# Altium project AND.PrjPcb
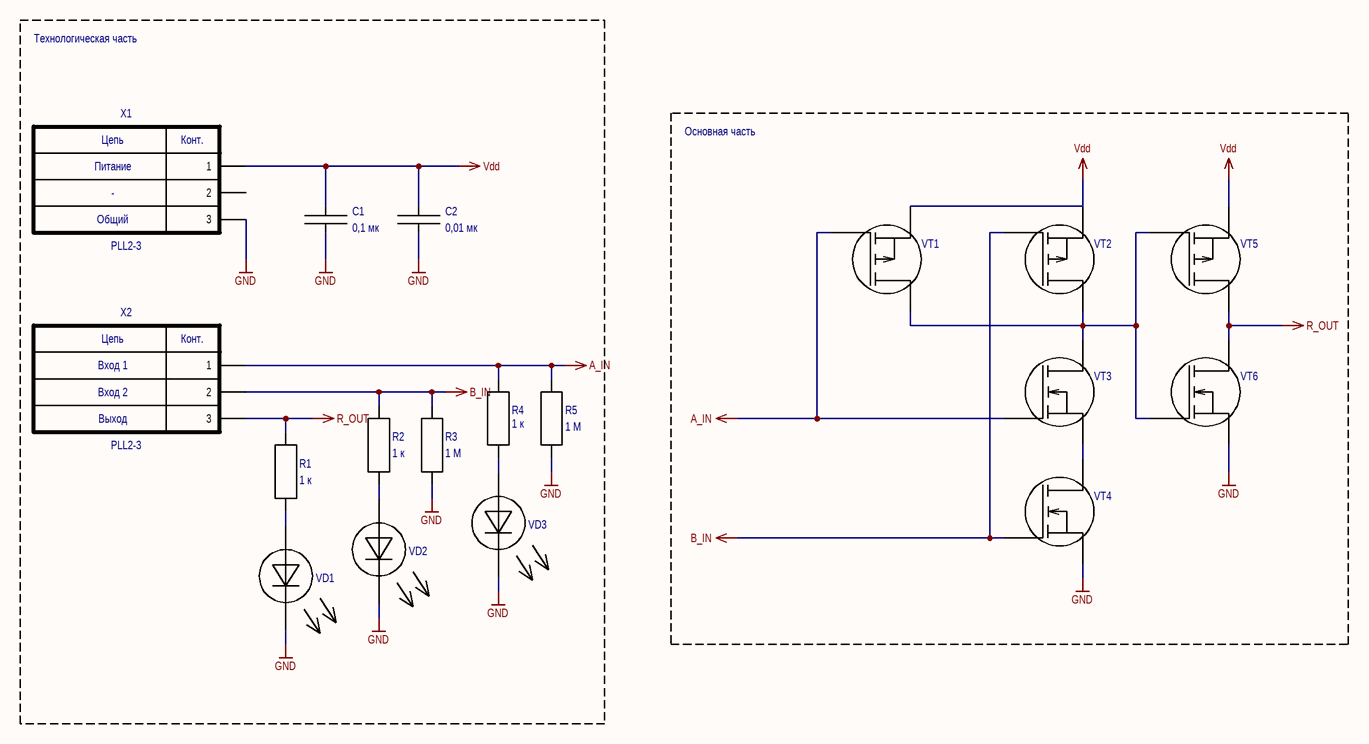
[diagram p0: Sheet1.SchDoc]
1 sheet, 18 parts. Net scope: global (net labels, ports and power ports of the same name join across sheets).
Board file: AND.PcbDoc

## Sheet Sheet1.SchDoc
size 420 x 297 mm; SheetNumber: 1; SheetTotal: 1

### Parts
C1  value 0,1 мк  [K10-79_1.6_0.8(0603)]  (hidden comment: 0,1 мкФ ±5 % *  0603, CC0603JRX7R8BB104)
C2  value 0,01 мк  [K10-79_1.6_0.8(0603)]  (hidden comment: 0,01 мкФ ±10 % *  0603, CC0603KPX7R8BB103)
R1  value 1 к  [P1-12-0.1(0603)]  (hidden comment: 1 кОм ±5 % 0603, RC0603JR-071KL)
R2  value 1 к  [P1-12-0.1(0603)]  (hidden comment: 1 кОм ±5 % 0603, RC0603JR-071KL)
R3  value 1 М  [P1-12-0.1(0603)]  (hidden comment: 1 кОм ±5 % 0603, RC0603JR-071KL)
R4  value 1 к  [P1-12-0.1(0603)]  (hidden comment: 1 кОм ±5 % 0603, RC0603JR-071KL)
R5  value 1 М  [P1-12-0.1(0603)]  (hidden comment: 1 кОм ±5 % 0603, RC0603JR-071KL)
VD1  VD - Светодиод  [LED 0603]  (value not drawn)
VD2  VD - Светодиод  [LED 0603]  (value not drawn)
VD3  VD - Светодиод  [LED 0603]  (value not drawn)
VT1  VT - Полевой транзистор P канал (MOSFET_P)  [SOT23(KT-46)]  (value not drawn)
VT2  VT - Полевой транзистор P канал (MOSFET_P)  [SOT23(KT-46)]  (value not drawn)
VT3  VT - Полевой транзистор N канал (MOSFET_N)  [SOT23(KT-46)]  (value not drawn)
VT4  VT - Полевой транзистор N канал (MOSFET_N)  [SOT23(KT-46)]  (value not drawn)
VT5  VT - Полевой транзистор P канал (MOSFET_P)  [SOT23(KT-46)]  (value not drawn)
VT6  VT - Полевой транзистор N канал (MOSFET_N)  [SOT23(KT-46)]  (value not drawn)
X1  value PLL2-3  1: Питание  3: Общий  [PCBComponent_1 - duplicate]  (hidden comment: KONT_POLE_POWER)
X2  value PLL2-3  1: Вход 1  3: Выход  2: Вход 2  [PCBComponent_1 - duplicate]  (hidden comment: KONT_POLE_POWER)

### Blocks framed on the sheet
Технологическая часть: C1 C2 R1-R5 VD1-VD3 X1 X2
Основная часть: VT1-VT6

### Nets
A_IN: R4.2 R5.2 VT1.3 VT3.3 X2.1
B_IN: R2.2 R3.2 VT2.3 VT4.3 X2.2
GND: C1.1 C2.1 R3.1 R5.1 VD1.2(C) VD2.2(C) VD3.2(C) VT4.2 VT6.2 X1.3
R_OUT: R1.2 VT5.2 VT6.1 X2.3
Vdd: C1.2 C2.2 VT1.1 VT2.1 VT5.1 X1.1
NetR1_1: R1.1 VD1.1(A)
NetR2_1: R2.1 VD2.1(A)
NetR4_1: R4.1 VD3.1(A)
NetVT1_2: VT1.2 VT2.2 VT3.1 VT5.3 VT6.3
NetVT3_2: VT3.2 VT4.1

Not connected (* = marked no-connect by the designer): X1 2

### Notes on the sheet
- Перв.примен.
- Справ. №
- Подп. и дата
- Инв.№ дубл.
- Взам. инв. №
- Изм.
- Лист
- № докум.
- Подп.
- Дата
- Лит.
- Масса
- Масштаб
- Пров.
- Т.контр
- Разраб.
- Схема электрическая принципиальная
- 1
- Листов
- Инв № подл.
- Н.контр.
- Утв.
- Копировал
- Формат А3
- (in symbol X - Контактное поле х3) Цепь; Конт.

### Library data of the parts
C1 = C - Конденсатор: Company: Yageo; Tolerance: 5 %; PartNumber: CC0603JRX7R8BB104; Voltage: *; Package: 0603
C2 = C - Конденсатор: Company: Yageo; Tolerance: 10 %; PartNumber: CC0603KPX7R8BB103; Voltage: *; Package: 0603
R1-R5 = R - Резистор: Company: Yageo; Tolerance: 5 %; PartNumber: RC0603JR-071KL; Package: 0603
VD1-VD3 = VD - Светодиод: PartNumber: GNL-0805UBC-TL; Company: G-nor; Value: GNL-0805UBC-TL; Package: 0603
VT1 VT2 VT5 = VT - Полевой транзистор P канал (MOSFET_P): VT; pin to pad: 1>2 2>3 3>1
VT3 VT4 VT6 = VT - Полевой транзистор N канал (MOSFET_N): VT; pin to pad: 1>3 3>1
X1 X2 = X - Контактное поле х3: Company: RUICHI; PartNumber: PLL2-3
  X1: 2: -